# Altium schematic sheet PowerSource.SchDoc
size A; SheetNumber: 2; SheetTotal: 2
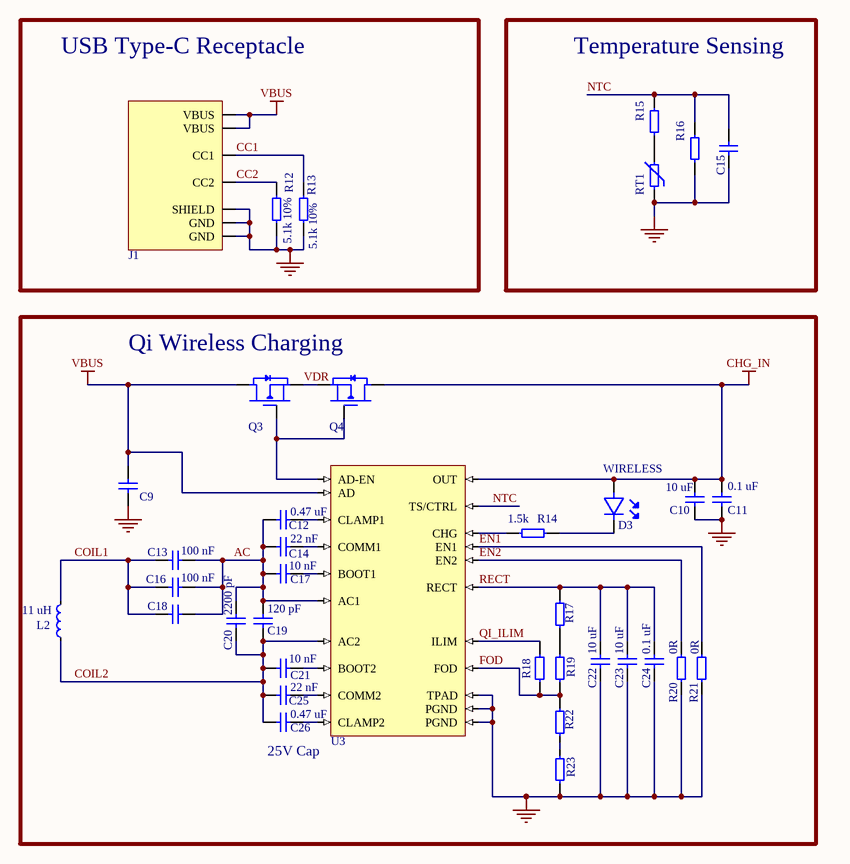
[diagram p0: PowerSource.SchDoc]

## Parts
C9  Capacitor  [0603 Capacitor]  (value not drawn)
C10  10 uF  [0603 Capacitor]
C11  0.1 uF  [0603 Capacitor]
C12  22 nF  [0603 Capacitor]
C13  100 nF  [0603 Capacitor]
C14  0.47 uF  [0603 Capacitor]
C15  Capacitor  [0603 Capacitor]  (value not drawn)
C16  100 nF  [0603 Capacitor]
C17  10 nF  [0603 Capacitor]
C18  Capacitor  [0603 Capacitor]  (value not drawn)
C19  120 pF  [0603 Capacitor]
C20  2200 pF  [0603 Capacitor]
C21  10 nF  [0603 Capacitor]
C22  10 uF  [0603 Capacitor]
C23  10 uF  [0603 Capacitor]
C24  0.1 uF  [0603 Capacitor]
C25  22 nF  [0603 Capacitor]
C26  0.47 uF  [0603 Capacitor]
D3  WIRELESS  [0603 LED]
J1  USB4125-GF-A  [USB4125]  (value not drawn)
L2  11 uH  [WURTH QI COIL]
Q3  CSD25404Q3  [CSD25404Q3]  (value not drawn)
Q4  CSD25404Q3  [CSD25404Q3]  (value not drawn)
R12  5.1k 10%  [0603 Resistor]
R13  5.1k 10%  [0603 Resistor]
R14  1.5k  [0603 Resistor]
R15  Resistor  [0603 Resistor]  (value not drawn)
R16  Resistor  [0603 Resistor]  (value not drawn)
R17  Resistor  [0603 Resistor]  (value not drawn)
R18  Resistor  [0603 Resistor]  (value not drawn)
R19  Resistor  [0603 Resistor]  (value not drawn)
R20  0R  [0603 Resistor]
R21  0R  [0603 Resistor]
R22  Resistor  [0603 Resistor]  (value not drawn)
R23  Resistor  [0603 Resistor]  (value not drawn)
RT1  ERT-J1VG103JA  [0603 Resistor]  (value not drawn)
U3  BQ51013BRHLR  [BQ51013B]  (value not drawn)

## Blocks framed on the sheet
USB Type-C Receptacle: J1 R12 R13
Temperature Sensing: C15 R15 R16 RT1
Qi Wireless Charging: C9-C14 C16-C26 D3 L2 Q3 Q4 R14 R17-R23 U3

## Nets
CHG_IN: C10.2 C11.2 D3.1 Q4.1 U3.4(OUT)
GND: C9.1 C10.1 C11.1 C15.1 C22.1 C23.1 C24.1 J1.A12(GND) J1.B12(GND) J1.SHIELD R12.1 R13.1 R16.1 R20.1 R21.1 R23.1 RT1.1 U3.1(PGND) U3.20(PGND) U3.21(TPAD)
VBUS: C9.2 J1.A9(VBUS) J1.B9(VBUS) Q3.1 U3.9(AD)
AC: C12.1 C13.2 C14.1 C16.1 C17.1 C18.1 C19.2 C20.2 U3.2(AC1)
CC1: J1.A5(CC1) R13.2
CC2: J1.B5(CC2) R12.2
COIL1: C13.1 C16.2 C18.2 L2.2
COIL2: C19.1 C20.1 C21.1 C25.1 C26.1 L2.1 U3.19(AC2)
EN1: R21.2 U3.10(EN1)
EN2: R20.2 U3.11(EN2)
FOD: R18.2 R19.1 R22.2 U3.14(FOD)
NTC: C15.2 R15.2 R16.2 U3.13(TS/CTRL)
QI_ILIM: R18.1 U3.12(ILIM)
RECT: C22.2 C23.2 C24.2 R17.1 U3.18(RECT)
VDR: Q3.5 Q4.5
NetC12_2: C12.2 U3.6(COMM1)
NetC14_2: C14.2 U3.5(CLAMP1)
NetC17_2: C17.2 U3.3(BOOT1)
NetC21_2: C21.2 U3.17(BOOT2)
NetC25_2: C25.2 U3.15(COMM2)
NetC26_2: C26.2 U3.16(CLAMP2)
NetD3_2: D3.2 R14.2
NetQ3_4: Q3.4 Q4.4 U3.8(AD-EN)
NetR14_1: R14.1 U3.7(CHG)
NetR15_1: R15.1 RT1.2
NetR17_2: R17.2 R19.2
NetR22_1: R22.1 R23.2

## Notes on the sheet
- 25V Cap

## Library data of the parts
C10-C14 C16 C17 C19-C26 = Capacitor
D3 = LED
J1 = USB4125-GF-A: Conn Rcp USB2.0 Typ C 24P SMD Ra; Manufacturer 1: GCT; Supplier 1: Digi-Key; Supplier Part Number 1: 1812J0160470FFT-ND; Manufacturer Part Number 1: USB4125-GF-A
L2 = 760308101214: RX 1 COIL 1 LAYER 26UH 1.1A; Manufacturer 1: Wurth Electronics; Logic Function: Receiver; Saturation Current: 2A; DC Resistance (DCR): 520mR; Self Resonant Frequency: 11MHz; Tolerance: 10%; Supplier 1: Digi-Key; Supplier Part Number 1: 732-8240-ND; Manufacturer Part Number 1: 760308101214; RoHS: No; Stock 1: 4065; Pricing 1: 1=7.49000, 10=6.93200, 48=6.30208, 96=5.72906, 192=5.20802 (USD); Min Operating Temperature: -20°C; Max Operating Temperature: 105°C; Inductance: 26uH; Current Rating: 1.1A; Height: 0.03inch; RoHS Compliant: No; ComponentLink1URL: https://katalog.we-online.de/pbs/datasheet/760308101214.pdf?src-supplier=Digi-Key; ComponentLink1Description: https://katalog.we-online.de/pbs/datasheet/760308101214.pdf?src-supplier=Digi-Key
Q3 Q4 = CSD25404Q3: MOSFET P-CH 20V 104A 8VSON; Manufacturer 1: Texas Instruments; Rds On Max: 6.5mR; Input Capacitance: 2.12nF; Max Power Dissipation: 2.8W; Rise Time: 8ns; Turn-On Delay Time: 13ns; Turn-Off Delay Time: 35ns; Gate to Source Voltage (Vgs): 12V; Element Configuration: Single; Supplier 1: Digi-Key; Supplier Part Number 1: 296-47255-1-ND; Manufacturer Part Number 1: CSD25404Q3; RoHS: Yes; Category: MOSFETs; Stock 1: 4064; Pricing 1: 1=1.21000, 10=1.07700, 25=1.02240, 100=0.84000, 500=0.69388, 1000=0.55444 (USD); Mount: Surface Mount; Number of Pins: 8; Contact Plating: Tin; Min Operating Temperature: -55°C; Max Operating Temperature: 150°C; Packaging: Tape and Reel; Drain to Source Voltage (Vdss): 20V; Continuous Drain Current (ID): 104A; Fall Time: 13ns; Lead Free: Contains Lead; RoHS Compliant: Yes; ComponentLink1URL: http://www.ti.com/lit/ds/symlink/csd25404q3.pdf?src-supplier=Digi-Key; ComponentLink1Description: http://www.ti.com/lit/ds/symlink/csd25404q3.pdf?src-supplier=Digi-Key; ComponentLink2URL: http://www.ti.com/lit/gpn/csd25404q3?src-supplier=Mouser; ComponentLink2Description: http://www.ti.com/lit/gpn/csd25404q3?src-supplier=Mouser
R12-R14 R20 R21 = Resistor
RT1 = ERT-J1VG103JA: Thermistor NTC 10KOhm 5% 2-Pin 0603 Punched Carrier T/R; Manufacturer 1: Panasonic; Resistance: 10kR; Max Power Dissipation: 100mW; Accuracy: 1%; Supplier 1: Digi-Key; Supplier Part Number 1: P12014CT-ND; Manufacturer Part Number 1: ERT-J1VG103JA; RoHS: Yes; Category: Thermistors; Stock 1: 61023; Pricing 1: 1=0.12000, 10=0.11400, 25=0.10920, 50=0.08740, 100=0.07490, 500=0.06552, 1000=0.05616 (USD); Mount: Surface Mount; Case/Package: 0603; Number of Pins: 2; Case Code (Metric): 1608; Case Code (Imperial): 0603; Min Operating Temperature: -40°C; Max Operating Temperature: 125°C; Packaging: Tape and Reel; Tolerance: 5%; Package Quantity: 4000; Termination: SMD/SMT; Series: ERT-J; Resistance Tolerance: 5%; Length: 1.6mm; Width: 800um; Depth: 0.8mm; Radiation Hardening: No; REACH SVHC: No SVHC; Lead Free: Lead Free; RoHS Compliant: Yes; ComponentLink1URL: https://datasheet.ciiva.com/30067/aua0000ce1-30067157.pdf?src-supplier=Onlinecomponents.com; ComponentLink1Description: https://datasheet.ciiva.com/30067/aua0000ce1-30067157.pdf?src-supplier=Onlinecomponents.com; ComponentLink2URL: https://datasheet.ciiva.com/46376/1314428-46376550.pdf?src-supplier=Element14; ComponentLink2Description: https://datasheet.ciiva.com/46376/1314428-46376550.pdf?src-supplier=Element14; ComponentLink3URL: https://datasheet.ciiva.com/16394/aua0000ce1-16394028.pdf?src-supplier=Future+Electronics; ComponentLink3Description: https://datasheet.ciiva.com/16394/aua0000ce1-16394028.pdf?src-supplier=Future+Electronics; ComponentLink4URL: https://datasheet.ciiva.com/46388/1314428-46388812.pdf?src-supplier=Element14; ComponentLink4Description: https://datasheet.ciiva.com/46388/1314428-46388812.pdf?src-supplier=Element14; ComponentLink5URL: https://datasheet.ciiva.com/3280/aua0000ce1-3280462.pdf?src-supplier=Avnet; ComponentLink5Description: https://datasheet.ciiva.com/3280/aua0000ce1-3280462.pdf?src-supplier=Avnet; ComponentLink6URL: https://datasheet.ciiva.com/1303/1314428-1303168.pdf?src-supplier=Farnell; ComponentLink6Description: https://datasheet.ciiva.com/1303/1314428-1303168.pdf?src-supplier=Farnell; ComponentLink7URL: https://datasheet.ciiva.com/2848/aua0000ce1-2848556.pdf?src-supplier=Digi-Key; ComponentLink7Description: https://datasheet.ciiva.com/2848/aua0000ce1-2848556.pdf?src-supplier=Digi-Key; ComponentLink8URL: https://datasheet.ciiva.com/2848/aua0000ce1-2848557.pdf?src-supplier=Digi-Key; ComponentLink8Description: https://datasheet.ciiva.com/2848/aua0000ce1-2848557.pdf?src-supplier=Digi-Key; ComponentLink9URL: https://datasheet.ciiva.com/2848/aua0000ce1-2848558.pdf?src-supplier=Digi-Key; ComponentLink9Description: https://datasheet.ciiva.com/2848/aua0000ce1-2848558.pdf?src-supplier=Digi-Key
U3 = BQ51013BRHLR: TEXAS INSTRUMENTS - BQ51013BRHLR - WIRELESS POWER SUPPLY RECEIVER, VQFN-20; Output Voltage: 5V; Output Current: 1.5A; Operating Supply Current: 8mA; Supplier 1: Digi-Key; Supplier Part Number 1: 296-38885-1-ND; Manufacturer 1: Texas Instruments; Manufacturer Part Number 1: BQ51013BRHLR; RoHS: Yes; Category: Power Management ICs; Stock 1: 9073; Pricing 1: 1=3.33000, 10=2.97000, 25=2.67280, 100=2.43540, 250=2.19780, 500=1.98396 (USD); Mount: Surface Mount; Case/Package: VQFN; Number of Pins: 20; Contact Plating: Gold; Min Operating Temperature: 0°C; Max Operating Temperature: 125°C; Packaging: Tape and Reel; Package Quantity: 3000; Logic Function: Receiver; Series: -; Lead Free: Lead Free; RoHS Compliant: Yes; ComponentLink1URL: https://datasheet.ciiva.com/6601/bq51013b-6601292.pdf?src-supplier=Digi-Key; ComponentLink1Description: https://datasheet.ciiva.com/6601/bq51013b-6601292.pdf?src-supplier=Digi-Key